# EAGLE design nixie_ticker (EAGLE 9.1.1)
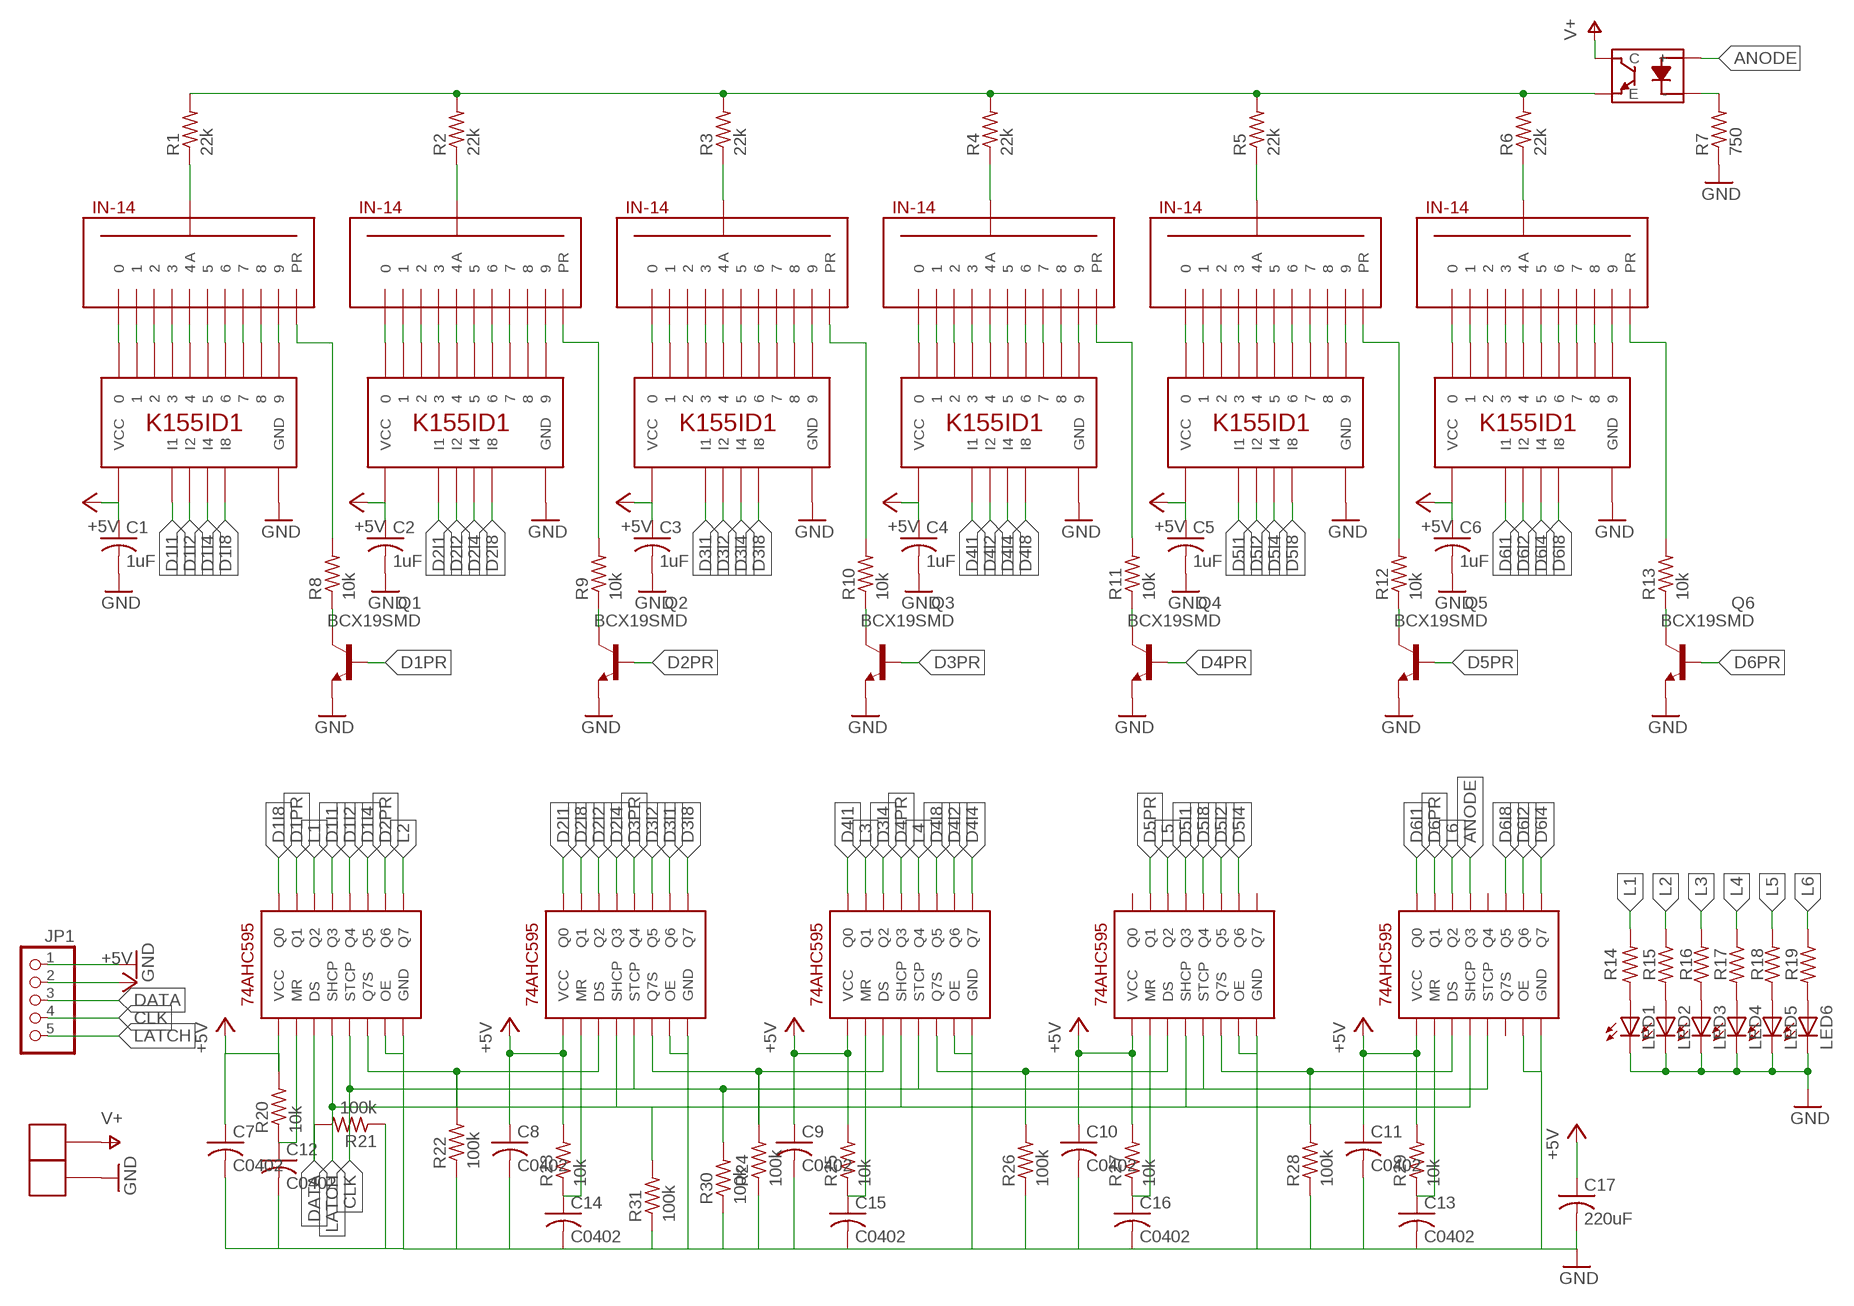
[diagram p0: schematic, sheet 1]

## Parts
C1  1uF  C0402  [C0402]
C2  1uF  C0402  [C0402]
C3  1uF  C0402  [C0402]
C4  1uF  C0402  [C0402]
C5  1uF  C0402  [C0402]
C6  1uF  C0402  [C0402]
C7  C0402  [C0402]
C8  C0402  [C0402]
C9  C0402  [C0402]
C10  C0402  [C0402]
C11  C0402  [C0402]
C12  C0402  [C0402]
C13  C0402  [C0402]
C14  C0402  [C0402]
C15  C0402  [C0402]
C16  C0402  [C0402]
C17  220uF  UUR1C221MCL6GS  [CAPAE830X1050]
JP1  PINHD-1X5  [1X05]
JP2  ZKFDS  [ZKFDS]
JP3  ZKFDS  [ZKFDS]
LED1  LEDCHIP-LED0603  [CHIP-LED0603]
LED2  LEDCHIP-LED0603  [CHIP-LED0603]
LED3  LEDCHIP-LED0603  [CHIP-LED0603]
LED4  LEDCHIP-LED0603  [CHIP-LED0603]
LED5  LEDCHIP-LED0603  [CHIP-LED0603]
LED6  LEDCHIP-LED0603  [CHIP-LED0603]
N1  IN14_12PIN12PIN  [IN14-12PIN]
N2  IN14_12PIN12PIN  [IN14-12PIN]
N3  IN14_12PIN12PIN  [IN14-12PIN]
N4  IN14_12PIN12PIN  [IN14-12PIN]
N5  IN14_12PIN12PIN  [IN14-12PIN]
N6  IN14_12PIN12PIN  [IN14-12PIN]
Q1  BCX19SMD  [SOT23-BEC]
Q2  BCX19SMD  [SOT23-BEC]
Q3  BCX19SMD  [SOT23-BEC]
Q4  BCX19SMD  [SOT23-BEC]
Q5  BCX19SMD  [SOT23-BEC]
Q6  BCX19SMD  [SOT23-BEC]
R1  22k  R-US_R1206  [R1206]
R2  22k  R-US_R1206  [R1206]
R3  22k  R-US_R1206  [R1206]
R4  22k  R-US_R1206  [R1206]
R5  22k  R-US_R1206  [R1206]
R6  22k  R-US_R1206  [R1206]
R7  750  R-US_R0603  [R0603]
R8  10k  R-US_R0805  [R0805]
R9  10k  R-US_R0805  [R0805]
R10  10k  R-US_R0805  [R0805]
R11  10k  R-US_R0805  [R0805]
R12  10k  R-US_R0805  [R0805]
R13  10k  R-US_R0805  [R0805]
R14  R-US_R0805  [R0805]
R15  R-US_R0805  [R0805]
R16  R-US_R0805  [R0805]
R17  R-US_R0805  [R0805]
R18  R-US_R0805  [R0805]
R19  R-US_R0805  [R0805]
R20  10k  R0402  [R0402]
R21  100k  R0402  [R0402]
R22  100k  R0402  [R0402]
R23  10k  R0402  [R0402]
R24  100k  R0402  [R0402]
R25  10k  R0402  [R0402]
R26  100k  R0402  [R0402]
R27  10k  R0402  [R0402]
R28  100k  R0402  [R0402]
R29  10k  R0402  [R0402]
R30  100k  R0402  [R0402]
R31  100k  R0402  [R0402]
U1  TLP3873D  [SOP254P1000X215-4]
U2  K155ID1  [DIP-16_SMD]
U3  K155ID1  [DIP-16_SMD]
U4  K155ID1  [DIP-16_SMD]
U5  K155ID1  [DIP-16_SMD]
U6  K155ID1  [DIP-16_SMD]
U7  K155ID1  [DIP-16_SMD]
U8  74AHC595  [16SOIC]
U9  74AHC595  [16SOIC]
U10  74AHC595  [16SOIC]
U11  74AHC595  [16SOIC]
U12  74AHC595  [16SOIC]

## Nets
+5V: C1.1(+) C2.1(+) C3.1(+) C4.1(+) C5.1(+) C6.1(+) C7.1(+) C8.1(+) C9.1(+) C10.1(+) C11.1(+) C17.1(+) JP1.2 R20.2 R23.2 R25.2 R27.2 R29.2 U2.P$5(VCC) U3.P$5(VCC) U4.P$5(VCC) U5.P$5(VCC) U6.P$5(VCC) U7.P$5(VCC) U8.P$16(VCC) U9.P$16(VCC) U10.P$16(VCC) U11.P$16(VCC) U12.P$16(VCC)
ANODE: U1.1(+) U12.P$3(Q3)
CLK: JP1.4 R30.2 U8.P$12(STCP) U9.P$12(STCP) U10.P$12(STCP) U11.P$12(STCP) U12.P$12(STCP)
D1I1: U2.P$3(I1) U8.P$3(Q3)
D1I2: U2.P$6(I2) U8.P$4(Q4)
D1I4: U2.P$7(I4) U8.P$5(Q5)
D1I8: U2.P$4(I8) U8.P$15(Q0)
D1PR: Q1.B U8.P$1(Q1)
D2I1: U3.P$3(I1) U9.P$15(Q0)
D2I2: U3.P$6(I2) U9.P$2(Q2)
D2I4: U3.P$7(I4) U9.P$3(Q3)
D2I8: U3.P$4(I8) U9.P$1(Q1)
D2PR: Q2.B U8.P$6(Q6)
D3I1: U4.P$3(I1) U9.P$6(Q6)
D3I2: U4.P$6(I2) U9.P$5(Q5)
D3I4: U4.P$7(I4) U10.P$2(Q2)
D3I8: U4.P$4(I8) U9.P$7(Q7)
D3PR: Q3.B U9.P$4(Q4)
D4I1: U5.P$3(I1) U10.P$15(Q0)
D4I2: U5.P$6(I2) U10.P$6(Q6)
D4I4: U5.P$7(I4) U10.P$7(Q7)
D4I8: U5.P$4(I8) U10.P$5(Q5)
D4PR: Q4.B U10.P$3(Q3)
D5I1: U6.P$3(I1) U11.P$3(Q3)
D5I2: U6.P$6(I2) U11.P$5(Q5)
D5I4: U6.P$7(I4) U11.P$6(Q6)
D5I8: U6.P$4(I8) U11.P$4(Q4)
D5PR: Q5.B U11.P$1(Q1)
D6I1: U7.P$3(I1) U12.P$15(Q0)
D6I2: U7.P$6(I2) U12.P$6(Q6)
D6I4: U7.P$7(I4) U12.P$7(Q7)
D6I8: U7.P$4(I8) U12.P$5(Q5)
D6PR: Q6.B U12.P$1(Q1)
DATA: JP1.3 R21.2 U8.P$14(DS)
GND: C1.2(-) C2.2(-) C3.2(-) C4.2(-) C5.2(-) C6.2(-) C7.2(-) C8.2(-) C9.2(-) C10.2(-) C11.2(-) C12.2(-) C13.2(-) C14.2(-) C15.2(-) C16.2(-) C17.2(-) JP1.1 JP3.P$1 JP3.P$2 LED1.C LED2.C LED3.C LED4.C LED5.C LED6.C Q1.E Q2.E Q3.E Q4.E Q5.E Q6.E R7.1 R21.1 R22.1 R24.1 R26.1 R28.1 R30.1 R31.1 U2.P$12(GND) U3.P$12(GND) U4.P$12(GND) U5.P$12(GND) U6.P$12(GND) U7.P$12(GND) U8.P$8(GND) U8.P$13(OE) U9.P$8(GND) U9.P$13(OE) U10.P$8(GND) U10.P$13(OE) U11.P$8(GND) U11.P$13(OE) U12.P$8(GND) U12.P$13(OE)
L1: R14.2 U8.P$2(Q2)
L2: R15.1 U8.P$7(Q7)
L3: R16.2 U10.P$1(Q1)
L4: R17.1 U10.P$4(Q4)
L5: R18.2 U11.P$2(Q2)
L6: R19.1 U12.P$2(Q2)
LATCH: JP1.5 R31.2 U8.P$11(SHCP) U9.P$11(SHCP) U10.P$11(SHCP) U11.P$11(SHCP) U12.P$11(SHCP)
N$1: N1.P$12 U2.P$16
N$2: N1.P$3 U2.P$15
N$3: N1.P$4 U2.P$8
N$4: N1.P$5 U2.P$9
N$5: N1.P$6 U2.P$13
N$6: N1.P$7 U2.P$14
N$7: N1.P$8 U2.P$11
N$8: N1.P$9 U2.P$10
N$9: N1.P$10 U2.P$1
N$10: N1.P$11 U2.P$2
N$11: N2.P$12 U3.P$16
N$12: N2.P$3 U3.P$15
N$13: N2.P$4 U3.P$8
N$14: N2.P$5 U3.P$9
N$15: N2.P$6 U3.P$13
N$16: N2.P$7 U3.P$14
N$17: N2.P$8 U3.P$11
N$18: N2.P$9 U3.P$10
N$19: N2.P$10 U3.P$1
N$20: N2.P$11 U3.P$2
N$21: R24.2 U9.P$9(Q7S) U10.P$14(DS)
N$22: R22.2 U8.P$9(Q7S) U9.P$14(DS)
N$23: R26.2 U10.P$9(Q7S) U11.P$14(DS)
N$24: R28.2 U11.P$9(Q7S) U12.P$14(DS)
N$25: LED2.A R15.2
N$26: C13.1(+) R29.1 U12.P$10(MR)
N$27: LED3.A R16.1
N$29: LED1.A R14.1
N$30: LED4.A R17.2
N$31: N3.P$12 U4.P$16
N$32: N3.P$3 U4.P$15
N$33: N3.P$4 U4.P$8
N$34: N3.P$5 U4.P$9
N$35: N3.P$6 U4.P$13
N$36: N3.P$7 U4.P$14
N$37: N3.P$8 U4.P$11
N$38: N3.P$9 U4.P$10
N$39: N3.P$10 U4.P$1
N$40: N3.P$11 U4.P$2
N$42: LED5.A R18.1
N$44: LED6.A R19.2
N$45: N1.P$2(PR) R8.2
N$46: Q1.C R8.1
N$47: N3.P$2(PR) R10.2
N$48: Q3.C R10.1
N$49: N5.P$2(PR) R12.2
N$50: Q5.C R12.1
N$51: N6.P$2(PR) R13.2
N$52: Q6.C R13.1
N$57: N1.P$1(A) R1.1
N$61: N4.P$12 U5.P$16
N$62: N4.P$3 U5.P$15
N$63: N4.P$4 U5.P$8
N$64: N4.P$5 U5.P$9
N$65: N4.P$6 U5.P$13
N$66: N4.P$7 U5.P$14
N$67: N4.P$8 U5.P$11
N$68: N4.P$9 U5.P$10
N$69: N4.P$10 U5.P$1
N$70: N4.P$11 U5.P$2
N$90: N5.P$1(A) R5.1
N$91: N5.P$12 U6.P$16
N$92: N5.P$3 U6.P$15
N$93: N5.P$4 U6.P$8
N$94: N5.P$5 U6.P$9
N$95: N5.P$6 U6.P$13
N$96: N5.P$7 U6.P$14
N$97: N5.P$8 U6.P$11
N$98: N5.P$9 U6.P$10
N$99: N5.P$10 U6.P$1
N$100: N5.P$11 U6.P$2
N$102: R1.2 R2.2 R3.2 R4.2 R5.2 R6.2 U1.3(E)
N$103: R7.2 U1.2(-)
N$104: N6.P$1(A) R6.1
N$105: N2.P$1(A) R2.1
N$108: C14.1(+) R23.1 U9.P$10(MR)
N$109: C12.1(+) R20.1 U8.P$10(MR)
N$110: C15.1(+) R25.1 U10.P$10(MR)
N$111: C16.1(+) R27.1 U11.P$10(MR)
N$118: N3.P$1(A) R3.1
N$121: N6.P$12 U7.P$16
N$122: N6.P$3 U7.P$15
N$123: N6.P$4 U7.P$8
N$124: N6.P$5 U7.P$9
N$125: N6.P$6 U7.P$13
N$126: N6.P$7 U7.P$14
N$127: N6.P$8 U7.P$11
N$128: N6.P$9 U7.P$10
N$129: N6.P$10 U7.P$1
N$130: N6.P$11 U7.P$2
N$145: N4.P$1(A) R4.1
N$160: Q2.C R9.1
N$161: Q4.C R11.1
N$162: N4.P$2(PR) R11.2
N$163: N2.P$2(PR) R9.2
V+: JP2.P$1 JP2.P$2 U1.4(C)
Unconnected: U11.P$7(Q7) U11.P$15(Q0) U12.P$4(Q4) U12.P$9(Q7S)

## Library data of the parts
C1-C16 = nixie_ticker:C0402
C17 = nixie_ticker:UUR1C221MCL6GS
JP1 = pinhead:PINHD-1X5: PIN HEADER
JP2 JP3 = nixie_ticker:ZKFDS
LED1-LED6 = led:LED: LED OSRAM: - CHIPLED LG R971, LG N971, LY N971, LG Q971, LY Q971, LO R971, LY R971 LH N974, LH R974 LS Q976, LO Q976, LY Q976 LO Q996 - Hyper CHIPLED LW Q18S LB Q993, LB Q99A, LB R99A - SideLED LS A670, LO A670, LY A670, LG A670, LP A670 LB A673, LV A673, LT A673, LW A673 LH A674 LY A675 LS A676, LA A676, LO A676, LY A676, LW A676 LS A679, LY A679, LG A679 - Hyper Micro SIDELED® LS Y876, LA Y876, LO Y876, LY Y876 LT Y87S - SmartLED LW L88C, LW L88S LB L89C, LB L89S, LG L890 LS L89K, LO L89K, LY L89K LS L896, LA L896, LO L896, LY L896 - TOPLED LS T670, LO T670, LY T670, LG T670, LP T670 LSG T670, LSP T670, LSY T670, LOP T670, LYG T670 LG T671, LOG T671, LSG T671 LB T673, LV T673, LT T673, LW T673 LH T674 LS T676, LA T676, LO T676, LY T676, LB T676, LH T676, LSB T676, LW T676 LB T67C, LV T67C, LT T67C, LS T67K, LO T67K, LY T67K, LW E67C LS E67B, LA E67B, LO E67B, LY E67B, LB E67C, LV E67C, LT E67C LW T67C LS T679, LY T679, LG T679 LS T770, LO T770, LY T770, LG T770, LP T770 LB T773, LV T773, LT T773, LW T773 LH T774 LS E675, LA E675, LY E675, LS T675 LS T776, LA T776, LO T776, LY T776, LB T776 LHGB T686 LT T68C, LB T68C - Hyper Mini TOPLED® LB M676 - Mini TOPLED Santana® LG M470 LS M47K, LO M47K, LY M47K Source: http://www.osram.convergy.de LUXEON: - LUMILED® LXK2-PW12-R00, LXK2-PW12-S00, LXK2-PW14-U00, LXK2-PW14-V00 LXK2-PM12-R00, LXK2-PM12-S00, LXK2-PM14-U00 LXK2-PE12-Q00, LXK2-PE12-R00, LXK2-PE12-S00, LXK2-PE14-T00, LXK2-PE14-U00 LXK2-PB12-K00, LXK2-PB12-L00, LXK2-PB12-M00, LXK2-PB14-N00, LXK2-PB14-P00, LXK2-PB14-Q00 LXK2-PR12-L00, LXK2-PR12-M00, LXK2-PR14-Q00, LXK2-PR14-R00 LXK2-PD12-Q00, LXK2-PD12-R00, LXK2-PD12-S00 LXK2-PH12-R00, LXK2-PH12-S00 LXK2-PL12-P00, LXK2-PL12-Q00, LXK2-PL12-R00 Source: www.luxeon.com KINGBRIGHT: KA-3528ASYC Source: www.kingbright.com
N1-N6 = nixie_ticker:IN14_12PIN
Q1-Q6 = transistor-npn:BCX19*: NPN Transistor
R1-R19 = resistor:R-US_: RESISTOR, American symbol
R20-R31 = nixie_ticker:R0402
U1 = nixie_ticker:TLP387
U2-U7 = nixie_ticker:K155ID1
U8-U12 = nixie_ticker:74AHC595

## Board
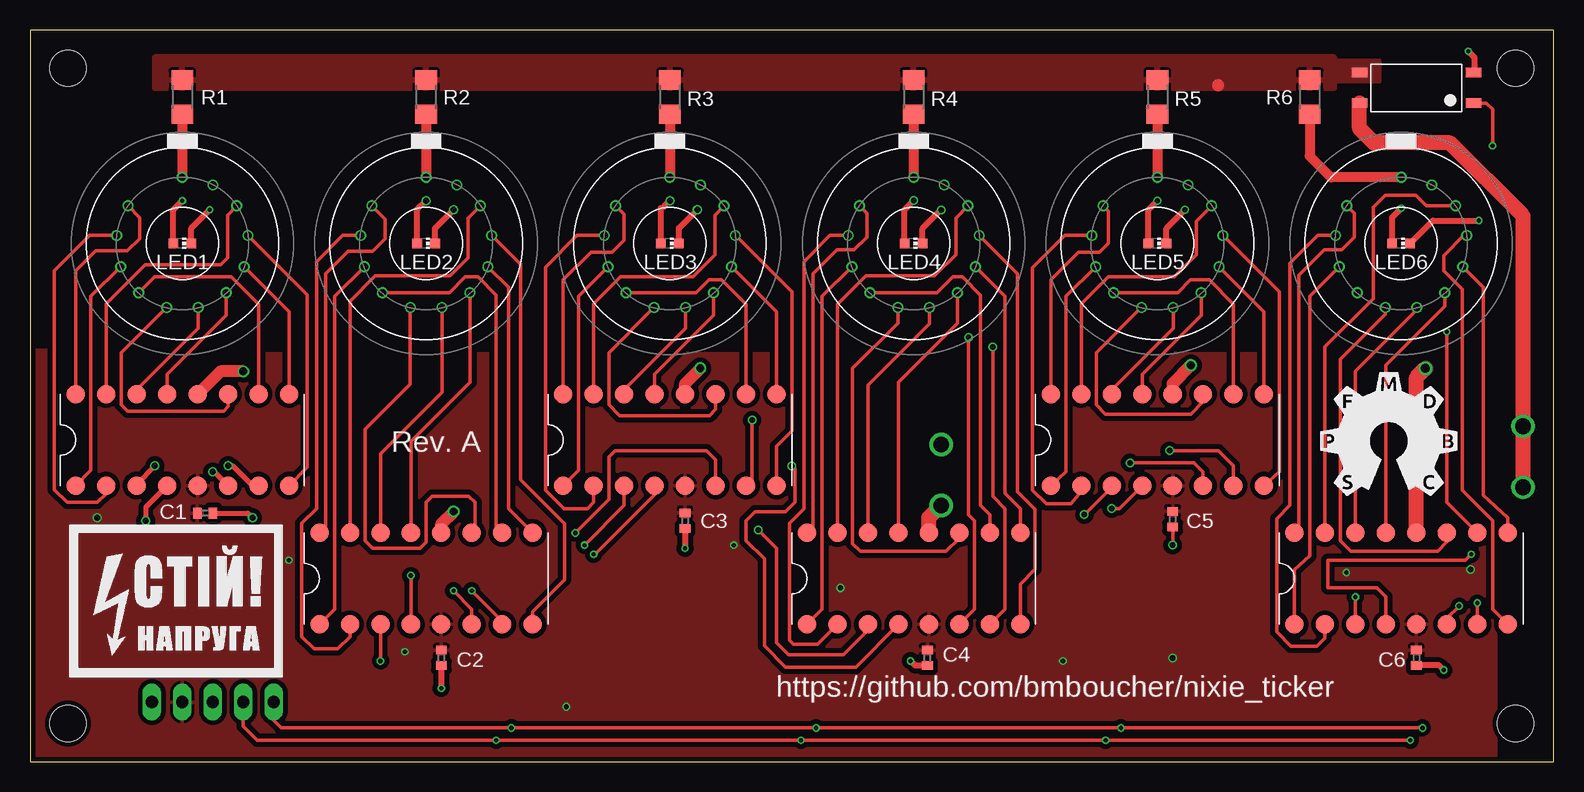
[diagram p1: board, top side]
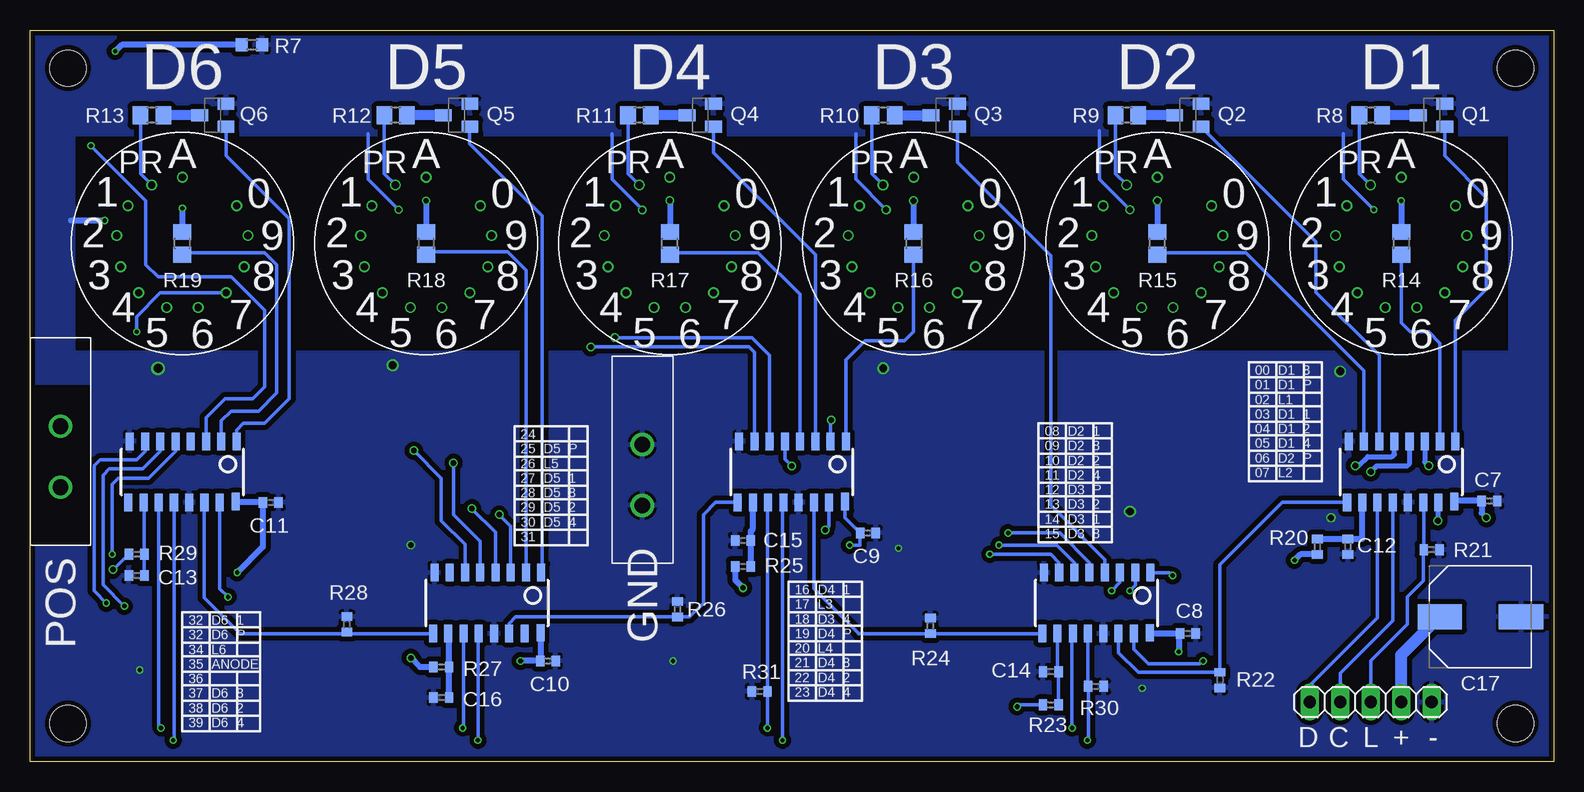
[diagram p2: board, bottom side, seen from below]

Size 127 x 60.96 mm. Coordinates in mm from the lower left corner, seen from the top.
Outline: 0,0 127,0 127,60.96 0,60.96 0,0
Copper layers (1*16): Top 0.035559375mm / dielectric 1.6mm / Bottom 0.035559375mm
Design rules "oshpark-2layer *": minimum track width 6mil, minimum drill 10mil, track to track 12mil, track to pad 12mil, pad to pad 6mil, via to via 6mil, smd to smd 6mil, copper to edge 15mil, drill to drill 6mil, minimum pad ring 5mil, minimum via ring 5mil, stop-mask expansion 2.5mil, vias tented up to drill 35mil, thermal gap 10mil
Holes 3 mm at 3.17,57.78 3.17,3.17 123.83,3.17 123.83,57.78

### Footprints (pad centres in the part's own frame; a part is rotated, then mirrored left to right if it is on the bottom)
C0402 = smd 0.7 x 0.9: 1 -0.65,0; 2 0.65,0
CAPAE830X1050 = smd 3.687 x 2.12: 1 -3.388,0; 2 3.388,0
1X05 = drill 1.016 long: 1 -5.08,0; 2 -2.54,0; 3 0,0; 4 2.54,0; 5 5.08,0
ZKFDS = drill 1.3: P$1 0,5.08; P$2 0,0
CHIP-LED0603 = smd 0.8 x 0.8: A 0,-0.75; C 0,0.75
IN14-12PIN = drill 0.6: P$1 0,5.5; P$2 2.556,4.87; P$3 4.526,3.124; P$4 5.46,0.663; P$5 5.143,-1.95; P$6 3.647,-4.117; P$7 1.316,-5.34; P$8 -1.316,-5.34; P$9 -3.647,-4.117; P$10 -5.143,-1.95; P$11 -5.46,0.663; P$12 -4.526,3.124
SOT23-BEC = smd 1 x 1.4: B -0.95,-1.1; C 0,1.1; E 0.95,-1.1
R1206 = smd 1.6 x 1.803: 1 -1.422,0; 2 1.422,0
R0603 = smd 1 x 1.1: 1 -0.85,0; 2 0.85,0
R0805 = smd 1.3 x 1.5: 1 -0.95,0; 2 0.95,0
R0402 = smd 0.7 x 0.9: 1 -0.65,0; 2 0.65,0
SOP254P1000X215-4 = smd 1.3 x 0.8: 1 -4.75,1.27; 2 -4.75,-1.27; 3 4.75,-1.27; 4 4.75,1.27
DIP-16_SMD = smd 1.524 x 1.524: P$1 -3.81,8.89; P$2 -3.81,6.35; P$3 -3.81,3.81; P$4 -3.81,1.27; P$5 -3.81,-1.27; P$6 -3.81,-3.81; P$7 -3.81,-6.35; P$8 -3.81,-8.89; P$9 3.81,-8.89; P$10 3.81,-6.35; P$11 3.81,-3.81; P$12 3.81,-1.27; P$13 3.81,1.27; P$14 3.81,3.81; P$15 3.81,6.35; P$16 3.81,8.89
16SOIC = smd 0.67 x 1.45: P$1 -4.51,-2.54; P$2 -3.24,-2.54; P$3 -1.97,-2.54; P$4 -0.7,-2.54; P$5 0.57,-2.54; P$6 1.84,-2.54; P$7 3.11,-2.54; P$8 4.38,-2.54; P$9 4.51,2.54; P$10 3.24,2.54; P$11 1.97,2.54; P$12 0.7,2.54; P$13 -0.57,2.54; P$14 -1.84,2.54; P$15 -3.11,2.54; P$16 -4.445,2.475

### Placement (x,y rotation side)
C1  14.61,20.7 0 top
C2  34.29,8.64 270 top
C3  54.61,20.07 270 top
C4  74.8,8.64 270 top
C5  95.25,20.19 270 top
C6  115.57,8.64 270 top
C7  5.33,21.72 0 bottom
C8  30.48,10.67 0 bottom
C9  57.15,19.05 0 bottom
C10  83.82,8.38 0 bottom
C11  106.93,21.59 0 bottom
C12  17.14,17.91 270 bottom
C13  118.11,15.49 180 bottom
C14  41.91,7.49 180 bottom
C15  67.56,18.41 180 bottom
C16  92.71,5.33 180 bottom
C17  6.1,12.06 0 bottom
JP1  15.24,4.95 180 bottom
JP2  124.46,22.86 0 bottom
JP3  75.95,21.34 0 bottom
LED1  12.7,43.18 270 top
LED2  33.02,43.18 270 top
LED3  53.34,43.18 270 top
LED4  73.66,43.18 270 top
LED5  93.98,43.18 270 top
LED6  114.3,43.18 270 top
N1  12.7,43.18 0 top
N2  33.02,43.18 0 top
N3  53.34,43.18 0 top
N4  73.66,43.18 0 top
N5  93.98,43.18 0 top
N6  114.3,43.18 0 top
Q1  10.16,53.85 90 bottom
Q2  30.48,53.85 90 bottom
Q3  50.8,53.85 90 bottom
Q4  71.12,53.85 90 bottom
Q5  91.44,53.85 90 bottom
Q6  111.76,53.85 90 bottom
R1  12.7,55.37 90 top
R2  33.02,55.37 90 top
R3  53.34,55.37 90 top
R4  73.66,55.37 90 top
R5  93.98,55.37 90 top
R6  106.68,55.37 90 top
R7  108.5,59.73 180 bottom
R8  15.24,53.85 180 bottom
R9  35.56,53.85 180 bottom
R10  55.88,53.85 180 bottom
R11  76.2,53.85 180 bottom
R12  96.52,53.85 180 bottom
R13  116.84,53.85 180 bottom
R14  12.7,43.18 270 bottom
R15  33.02,43.18 90 bottom
R16  53.34,43.18 270 bottom
R17  73.66,43.18 90 bottom
R18  93.98,43.18 270 bottom
R19  114.3,43.18 90 bottom
R20  19.68,17.91 270 bottom
R21  10.16,17.65 180 bottom
R22  27.81,6.79 90 bottom
R23  41.91,4.72 180 bottom
R24  51.94,11.3 270 bottom
R25  67.56,16.26 180 bottom
R26  73.03,12.7 270 bottom
R27  92.71,7.87 180 bottom
R28  100.58,11.43 270 bottom
R29  118.11,17.27 180 bottom
R30  38.14,6.26 180 bottom
R31  66.17,5.84 0 bottom
U1  115.57,56.13 180 top
U2  12.7,26.8 90 top
U3  33.02,15.24 90 top
U4  53.34,26.8 90 top
U5  73.66,15.24 90 top
U6  93.98,26.8 90 top
U7  114.3,15.24 90 top
U8  12.7,24.13 180 bottom
U9  38.1,13.21 180 bottom
U10  63.5,24.13 180 bottom
U11  88.9,13.21 180 bottom
U12  114.3,24.13 180 bottom

### Tracks (layer width: path | path; a pad name or v marks a point on that pad's centre or on a via)
+5V  (via drill 0.35, 0.4, 0.45, 0.5)
  Bottom 0.305: v58.67,18.03 57.8,18.03 C9.1 59.07,20.32 59.07,21.64 U10.P$16 | R23.2 44.7,4.72 v44.7,4.57 | R29.2 120.03,16 v120.09,16
  Bottom 0.508: U8.P$16 8.19,21.72 C7.1 5.98,20.72 v5.59,20.32 | R20.2 21.1,17.26 v21.59,16.76 | R25.2 68.21,15.13 v67.56,14.48 | U9.P$16 33.59,10.67 C8.1 31.24,10.67 v31.24,9.14 | U11.P$16 84.45,8.38 C10.1 v86.11,8.38 | R27.2 94.49,7.87 v95.25,8.64 | U12.P$16 109.79,21.59 C11.1 107.58,17.89 v109.73,15.75
  Bottom 1.016: JP1.2 12.7,8.89 9.91,11.68 9.87,11.68 C17.1
  pour Top (isolate 0.406, rank 4): 0,34.29 122.17,34.29 122.17,0 0,0
  cutout Top (isolate 0.406, rank 4): 3.81,52.07 123.09,52.07 123.19,51.97 123.19,34.29 3.81,34.29
ANODE  (via drill 0.35)
  Top 0.305: v121.92,51.31 121.92,54.36 121.41,54.86 U1.1
  Bottom 0.305: U12.P$3 112.33,28.64 110.74,30.23 108.46,30.23 107.44,31.24 107.44,37.59 110.24,40.39 116.33,40.39 117.35,41.4 117.35,46.74 v121.92,51.31
CLK  (via drill 0.35)
  Top 0.305: v115.06,1.78 v89.66,1.78 v64.26,1.78 v38.86,1.78 18.92,1.78 17.78,2.92 JP1.4
  Bottom 0.305: JP1.4 17.78,7.37 13.4,11.75 U8.P$12 | U12.P$12 115,1.78 v115.06,1.78 | U9.P$12 R30.2 38.79,1.78 v38.86,1.78 | v64.26,1.78 64.26,21.59 U10.P$12 | U11.P$12 89.66,10.67 v89.66,1.78
D1I1  (via drill 0.5)
  Top 0.406: v10.41,24.64 8.89,23.11 U2.P$3
  Bottom 0.406: U8.P$3 10.73,24.95 v10.41,24.64
D1I2  (via drill 0.5)
  Top 0.406: U2.P$6 15.37,24.13 v15.24,24.13
  Bottom 0.406: U8.P$4 12,24.83 12.19,24.64 14.73,24.64 v15.24,24.13
D1I4  (via drill 0.5)
  Top 0.406: U2.P$7 18.54,22.99 16.89,24.64 v16.51,24.64
  Bottom 0.406: U8.P$5 13.27,25.59 13.46,25.4 15.49,25.4 16.26,24.64 v16.51,24.64
D1I8  (via drill 0.5)
  Top 0.406: U2.P$4 9.65,21.21 v9.65,20.07
  Bottom 0.406: v9.65,20.07 9.59,20.13 U8.P$15
D1PR
  Bottom 0.305: U8.P$1 8.19,36.77 5.59,39.37 5.59,46.99 9.06,50.46 Q1.B
D2I1  (via drill 0.35)
  Top 0.305: v29.21,8.38 U3.P$3
  Bottom 0.305: U9.P$15 34.99,9.34 33.78,8.13 29.46,8.13 v29.21,8.38
D2I2  (via drill 0.35)
  Top 0.305: v35.31,14.22 36.83,12.7 U3.P$6
  Bottom 0.305: v35.31,14.22 34.86,14.67 U9.P$2
D2I4  (via drill 0.35)
  Top 0.305: v36.83,14.22 39.37,11.68 U3.P$7
  Bottom 0.305: v36.83,14.22 36.13,14.92 U9.P$3
D2I8  (via drill 0.35)
  Top 0.305: v31.75,15.49 U3.P$4
  Bottom 0.305: U9.P$1 32,15.75 v31.75,15.49
D2PR
  Bottom 0.305: Q2.B 19.81,43.33 19.81,39.12 14.54,33.84 U8.P$6
D3I1  (via drill 0.35)
  Top 0.305: v46.23,18.03 49.53,21.34 U4.P$3
  Bottom 0.305: U9.P$6 39.94,16.57 41.4,18.03 v46.23,18.03
D3I2  (via drill 0.35)
  Top 0.305: v45.47,19.05 48.26,21.84 48.26,25.4 48.77,25.91 56.39,25.91 57.15,25.15 U4.P$6
  Bottom 0.305: U9.P$5 38.67,16.57 41.15,19.05 v45.47,19.05
D3I4  (via drill 0.45)
  Top 0.305: U4.P$7 60.2,23.5 v60.2,28.45
  Bottom 0.305: U10.P$2 60.26,28.39 v60.2,28.45
D3I8  (via drill 0.35)
  Top 0.305: v46.99,17.27 47.12,17.27 52.07,22.23 U4.P$4
  Bottom 0.305: U9.P$7 41.21,16.57 41.91,17.27 v46.99,17.27
D3PR
  Bottom 0.305: Q3.B 49.7,49.95 41.91,42.16 41.91,21.34 37.4,16.83 U9.P$4
D4I1  (via drill 0.45)
  Top 0.305: v60.71,19.3 62.23,17.78 62.23,9.91 63.25,8.89 67.82,8.89 69.85,10.92 U5.P$3
  Bottom 0.305: U10.P$15 60.39,19.62 v60.71,19.3
D4I2  (via drill 0.45)
  Top 0.305: v78.23,35.35 78.23,20.57 78.74,20.07 78.74,12.7 U5.P$6
  Bottom 0.305: U10.P$6 65.34,33.84 66.8,35.31 78.19,35.31 v78.23,35.35
D4I4  (via drill 0.45)
  Top 0.305: v80.26,34.54 80.26,22.1 81.28,21.08 81.28,12.7 U5.P$7
  Bottom 0.305: U10.P$7 66.61,34.1 67.06,34.54 v80.26,34.54
D4I8  (via drill 0.45)
  Top 0.305: v63.5,24.64 63.75,24.38 63.75,21.59 62.99,20.83 60.45,20.83 59.69,20.07 59.69,18.41 61.21,16.89 61.21,9.65 62.99,7.87 68.83,7.87 U5.P$4
  Bottom 0.305: U10.P$5 64.07,25.21 v63.5,24.64
D4PR
  Bottom 0.305: U10.P$3 61.53,42.23 70.02,50.72 Q4.B
D5I1  (via drill 0.45)
  Top 0.305: v87.88,20.57 90.17,22.86 U6.P$3
  Bottom 0.305: U11.P$3 86.93,19.62 v87.88,20.57
D5I2  (via drill 0.45)
  Top 0.305: v91.69,24.89 97.03,24.89 97.79,24.13 U6.P$6
  Bottom 0.305: U11.P$5 89.47,18.35 91.69,20.57 v91.69,24.89
D5I4  (via drill 0.45)
  Top 0.305: v95,25.91 99.06,25.91 100.33,24.64 U6.P$7
  Bottom 0.305: U11.P$6 90.74,18.1 92.71,20.07 92.71,23.62 v95,25.91
D5I8  (via drill 0.45)
  Top 0.305: v90.17,21.08 90.81,21.08 U6.P$4
  Bottom 0.305: U11.P$4 88.2,19.11 v90.17,21.08
D5PR
  Bottom 0.305: Q5.B 90.34,51.48 84.33,45.47 84.33,15.81
  Bottom 0.508: 84.33,15.81 U11.P$1
D6I1  (via drill 0.35)
  Top 0.305: v110.49,13.72 U7.P$3
  Bottom 0.305: U12.P$15 111.19,14.42 v110.49,13.72
D6I2  (via drill 0.35)
  Top 0.305: v119.13,12.95 118.11,11.94 U7.P$6
  Bottom 0.305: U12.P$6 116.14,25.85 117.6,24.38 120.4,24.38 120.9,23.88 120.9,14.73 v119.13,12.95
D6I4  (via drill 0.35)
  Top 0.305: v120.65,13.21 U7.P$7
  Bottom 0.305: U12.P$7 117.41,25.85 118.11,25.15 121.16,25.15 121.67,24.64 121.67,14.22 v120.65,13.21
D6I8  (via drill 0.35)
  Top 0.305: v120.14,17.27 119.63,16.76 108.21,16.76 108.21,14.48 112.27,14.48 113.03,13.72 U7.P$4
  Bottom 0.305: U12.P$5 114.87,25.85 117.09,23.62 119.63,23.62 120.14,23.11 v120.14,17.27
D6PR
  Bottom 0.305: Q6.B 110.66,50.46 105.41,45.21 105.41,30.23 107.44,28.19 109.22,28.19 109.79,27.62 U12.P$1
DATA
  Bottom 0.305: JP1.3 15.24,8.38 12.19,11.43 12.19,13.72 10.86,15.05 10.86,17.6 | R21.2 10.81,21.54
  Bottom 0.508: 10.86,17.6 R21.2 | 10.81,21.54 U8.P$14
GND  (via drill 0.35, 0.4, 0.45, 0.5, 0.65 pad 0.75, 0.75)
  Top 0.305: C5.2 v95.25,18.03
  Top 0.406: C1.2 18.16,20.7 v18.54,20.32
  Top 0.508: LED1.C 13.45,44.44 v14.99,45.97 | v35.31,45.97 33.77,44.44 LED2.C | C2.2 v34.29,6.1 | C6.2 115.57,8.02 117.46,8.02 v117.86,7.62 | C4.2 73.8,7.99 v73.41,8.38 | C3.2 v54.61,17.78 | v55.63,45.97 55.63,45.93 55.59,45.95 54.09,44.45 LED3.C | LED4.C 74.41,44.44 v75.95,45.97 | LED5.C 94.73,44.44 v96.27,45.97 | LED6.C 116.95,45.09 v120.78,45.09
  Top 1.016: v17.78,32.51 15.88,32.51 U2.P$12 | 34.29,19.3 U3.P$12 34.29,19.81 v35.31,20.83 | U4.P$12 54.61,31.5 v55.88,32.77 | U6.P$12 95.25,31.5 v96.77,33.02
  Top 1.27: U7.P$12 115.57,32 v116.33,32.77 | U5.P$12 74.93,20.32 JP3.P$2
  Bottom 0.305: v14.99,45.97 17.53,48.51 17.53,52.32 | v35.31,45.97 37.85,48.51 37.85,52.58 | v55.63,45.97 58.17,48.51 58.17,52.32 | v75.95,45.97 78.49,48.51 78.49,52.32 | v96.27,45.97 98.81,48.51 98.81,52.32
  Bottom 0.508: v120.78,45.09 123.57,45.09
  pour Bottom (isolate 0.406, rank 6): 0,60.96 127,60.96 127,0 0,0
L1
  Bottom 0.305: U8.P$2 9.46,34.86 10.41,35.81 11.94,35.81 12.7,36.58 R14.2
L2
  Bottom 0.305: U8.P$7 15.81,32.57 25.65,42.42 32.83,42.42
  Bottom 0.508: 32.83,42.42 R15.1
L3
  Bottom 0.305: R16.2 53.34,35.81 54.1,35.05 57.4,35.05 58.99,33.47 U10.P$1
L4
  Bottom 0.305: U10.P$4 62.8,38.92 66.29,42.42 73.47,42.42
  Bottom 0.508: 73.47,42.42 R17.1
L5
  Bottom 0.305: U11.P$2 85.66,40.96 87.2,42.49 93.72,42.49
  Bottom 0.508: 93.72,42.49 R18.2
L6
  Bottom 0.305: R19.1 114.11,42.42 107.44,42.42 106.43,41.4 106.43,30.73 107.95,29.21 110.24,29.21 111.06,28.39 U12.P$2
LATCH  (via drill 0.35)
  Top 0.305: v116.08,2.79 v90.93,2.79 v65.53,2.79 v40.13,2.79 20.95,2.79 20.32,3.43 JP1.5
  Bottom 0.305: JP1.5 20.32,6.35 14.67,12 U8.P$11 | U9.P$11 40.13,10.67 v40.13,2.79 | v65.53,2.79 65.53,5.83 R31.2 65.52,21.54 U10.P$11 | U11.P$11 90.87,2.79 v90.93,2.79 | U12.P$11 116.27,2.99 v116.08,2.79
N$1
  Top 0.305: N1.P$12 9.14,45.33 9.14,43.58 8.11,42.55 5.46,42.55 3.81,40.89 U2.P$16
N$2
  Top 0.305: U2.P$15 6.35,38.14 9.61,41.4 15.88,41.4 16.46,41.99 16.46,45.54 N1.P$3
N$3
  Top 0.305: U2.P$8 23.11,24.51 23.11,38.89 N1.P$4
N$4
  Top 0.305: U2.P$9 21.59,37.48 N1.P$5
N$5
  Top 0.305: U2.P$13 11.43,32.26 16.35,37.17 N1.P$6
N$6
  Top 0.305: U2.P$14 8.89,30.99 14.02,36.11 N1.P$7
N$7
  Top 0.305: U2.P$11 16.51,29.59 16.13,29.21 8.13,29.21 7.62,29.72 7.62,34.08 N1.P$8
N$8
  Top 0.305: U2.P$10 19.05,38.1 16.76,40.39 10.38,40.39 N1.P$9
N$9
  Top 0.305: U2.P$1 5.08,24.26 5.08,38.75 N1.P$10
N$10
  Top 0.305: N1.P$11 4.98,43.84 2.03,40.89 2.03,22.66 3.1,21.59 5.33,21.59 5.62,21.59 6.35,22.32 U2.P$2
N$11
  Top 0.305: U3.P$16 24.64,19.56 24.64,40.64 26.51,42.51 28.57,42.51 29.62,43.56 29.62,45.18 N2.P$12
N$12
  Top 0.305: U3.P$15 26.67,38.35 28.78,40.46 35.01,40.46 36.53,41.99 36.53,45.29 N2.P$3
N$13
  Top 0.305: U3.P$8 41.91,12.5 44.58,15.17 44.58,19.81 40.89,23.5 40.89,41.43 N2.P$4
N$14
  Top 0.305: U3.P$9 39.88,21.08 39.88,39.51 N2.P$5
N$15
  Top 0.305: U3.P$13 31.75,26.67 36.67,31.59 N2.P$6
N$16
  Top 0.305: U3.P$14 29.21,25.65 34.34,30.78 N2.P$7
N$17
  Top 0.305: N2.P$8 31.7,31.45 27.94,27.69 27.94,18.41 28.57,17.78 32.51,17.78 33.02,18.29 33.02,21.59 33.53,22.1 36.58,22.1 37.08,21.59 37.08,19.3 U3.P$11 37.08,18.8
N$18
  Top 0.305: U3.P$10 38.86,19.56 38.86,38.86 37.34,40.39 36.28,40.39 34.96,39.06 N2.P$9
N$19
  Top 0.305: U3.P$1 25.4,12.7 25.4,38.75 N2.P$10
N$20
  Top 0.305: N2.P$11 26.06,43.84 23.88,41.66 23.88,21.08 22.66,19.86 22.66,10.42 23.68,9.4 25.65,9.4 26.67,10.41 U3.P$2
N$21
  Bottom 0.305: 42.61,10.68 U9.P$9 51.94,10.67 R24.2 57.93,10.65 57.93,10.68 61.66,14.42 U10.P$14
N$22
  Bottom 0.305: U8.P$9 22.61,21.59 27.8,16.39 R22.2 34.62,7.44 36.26,9.08 U9.P$14
N$23
  Bottom 0.305: U11.P$14 87.06,11.49 86.5,12.05 R26.2 72.02,12.05 70.87,13.21 70.87,20.57 69.85,21.59 U10.P$9
N$24
  Bottom 0.305: U12.P$14 112.46,13.65 109.47,10.67 100.58,10.67 | 100.58,10.67 R28.2 100.58,10.67 | 100.58,10.67 U11.P$9
N$25  (via drill 0.5)
  Top 0.508: v33.02,46.74 32.29,46 32.27,45.99 LED2.A
  Bottom 0.508: R15.2 33.02,45.47 v33.02,46.74
N$26
  Bottom 0.305: C13.1 R29.1 117.46,21.51 U12.P$10
N$27  (via drill 0.5)
  Top 0.508: v53.34,46.74 52.86,46.26 52.59,46.11 LED3.A
  Bottom 0.508: v53.34,46.74 R16.1
N$29  (via drill 0.35)
  Top 0.508: v12.7,46.74 11.97,46 11.95,45.99 LED1.A
  Bottom 0.508: v12.7,46.74 R14.1
N$30  (via drill 0.45)
  Top 0.508: LED4.A 72.91,45.99 v73.66,46.74
  Bottom 0.508: v73.66,46.74 R17.2
N$31
  Top 0.305: U4.P$16 44.45,40.13 46.76,42.44 48.51,42.44 49.53,43.45 49.53,45.59 N3.P$12
N$32
  Top 0.305: U4.P$15 46.99,38.14 49.24,40.39 55.25,40.39 57.1,42.24 57.1,45.54 N3.P$3
N$33
  Top 0.305: N3.P$4 63.5,39.14 63.5,27.56 62.23,26.29 U4.P$8
N$34
  Top 0.305: U4.P$9 62.23,37.48 N3.P$5
N$35
  Top 0.305: U4.P$13 52.07,32.26 56.99,37.17 N3.P$6
N$36
  Top 0.305: U4.P$14 49.53,30.99 54.66,36.11 N3.P$7
N$37
  Top 0.305: U4.P$11 57.15,29.34 56.64,28.83 49.15,28.83 48.26,29.72 48.26,34.08 N3.P$8
N$38
  Top 0.305: U4.P$10 59.69,38.1 57.66,40.13 56.6,40.13 55.53,39.06 N3.P$9
N$39
  Top 0.305: U4.P$1 45.72,24.26 45.72,38.75 N3.P$10
N$40
  Top 0.305: N3.P$11 45.62,43.84 42.98,41.2 42.98,22.61 44.5,21.08 46.48,21.08 46.99,21.59 U4.P$2
N$42  (via drill 0.4)
  Top 0.508: LED5.A 93.23,45.99 v93.98,46.74
  Bottom 0.508: v93.98,46.74 R18.1
N$44  (via drill 0.35)
  Top 0.508: LED6.A 113.55,45.35 v114.3,46.1
  Bottom 0.508: v114.3,46.1 R19.2
N$45
  Bottom 0.305: R8.2 16.19,48.98 N1.P$2
N$46
  Bottom 0.813: Q1.C R8.1
N$47
  Bottom 0.305: R10.2 56.83,48.98 N3.P$2
N$48
  Bottom 0.813: R10.1 Q3.C
N$49
  Bottom 0.305: R12.2 97.47,48.98 N5.P$2
N$50
  Bottom 0.813: Q5.C R12.1
N$51
  Bottom 0.305: R13.2 117.79,48.98 N6.P$2
N$52
  Bottom 0.813: Q6.C R13.1
N$57
  Top 0.813: R1.1 N1.P$1
N$61
  Top 0.305: N4.P$12 69.75,45.69 69.75,43.69 68.7,42.64 67.27,42.64 65.28,40.64 65.28,26.67 65.28,19.34 65.18,19.46 U5.P$16
N$62
  Top 0.305: U5.P$15 67.31,38.1 69.67,40.46 75.39,40.46 77.17,42.24 77.17,45.29 N4.P$3
N$63
  Top 0.305: U5.P$8 82.55,14.79 83.77,16 83.77,21.01 82.3,22.48 82.3,40.67 N4.P$4
N$64
  Top 0.305: N4.P$5 81.28,38.75 81.28,22.35 82.55,21.08 U5.P$9
N$65
  Top 0.305: U5.P$13 72.39,31.62 77.31,36.54 N4.P$6
N$66
  Top 0.305: U5.P$14 69.85,31.37 74.98,36.49 N4.P$7
N$67
  Top 0.305: N4.P$8 72.34,36.53 68.58,32.77 68.58,18.16 69.22,17.53 76.38,17.53 77.47,18.62 U5.P$11
N$68
  Top 0.305: N4.P$9 75.6,39.06 76.92,40.39 77.72,40.39 79.25,38.86 79.25,21.34 80.01,20.57 U5.P$10
N$69
  Top 0.305: U5.P$1 66.04,12.7 66.04,38.75 N4.P$10
N$70
  Top 0.305: N4.P$11 66.7,43.84 64.52,41.66 64.52,21.08 63.3,19.86 63.3,10.67 | 63.3,10.42 63.3,10.67 | 63.3,10.67 63.3,10.11 63.63,9.78 65.66,9.78 U5.P$2
N$89
  cutout Bottom (isolate 0.406): 123.19,52.07 3.81,52.07 3.81,34.29 108.97,34.29 109.98,34.29 116.59,34.29 123.19,34.29
N$90
  Top 0.813: R5.1 N5.P$1
N$91
  Top 0.305: U6.P$16 85.09,40.13 87.39,42.44 89.15,42.44 89.92,43.2 89.92,45.84 N5.P$12
N$92
  Top 0.305: U6.P$15 87.63,38.14 89.88,40.39 95.38,40.39 97.24,42.24 97.24,45.03 N5.P$3
N$93
  Top 0.305: U6.P$8 104.14,24.13 104.14,39.14 N5.P$4
N$94
  Top 0.305: U6.P$9 102.87,37.48 N5.P$5
N$95
  Top 0.305: U6.P$13 92.71,32.26 97.63,37.17 N5.P$6
N$96
  Top 0.305: U6.P$14 90.17,30.99 95.3,36.11 N5.P$7
N$97
  Top 0.305: U6.P$11 97.79,29.97 96.77,28.96 89.66,28.96 88.9,29.72 88.9,34.08 N5.P$8
N$98
  Top 0.305: U6.P$10 100.33,38.1 98.3,40.13 96.74,40.13 95.67,39.06 N5.P$9
N$99
  Top 0.305: U6.P$1 86.36,24.13 86.36,38.75 N5.P$10
N$100
  Top 0.305: N5.P$11 86.26,43.84 83.57,41.15 83.57,22.61 84.71,21.46 86.77,21.46 87.63,22.54 U6.P$2
N$102
  Top 1.016: 99.06,56.32 99.06,56.39
  pour Top: 10.41,56.13 108.71,56.13 108.71,56.64 108.71,58.67 10.41,58.67
  pour Top (no thermals): 108.71,58.42 112.52,58.42 112.52,56.64 108.71,56.64
N$103  (via drill 0.35)
  Top 0.305: 120.4,57.4 U1.2
  Top 0.508: v119.89,59.18 120.4,58.67 120.4,57.4
  Bottom 0.508: R7.2 119.34,59.73 v119.89,59.18
N$104
  Top 0.813: R6.1 106.68,50.46 108.46,48.68 N6.P$1
N$105
  Top 0.813: R2.1 N2.P$1
N$108
  Bottom 0.305: U9.P$10 41.34,7.49 C14.1 R23.1
N$109
  Bottom 0.508: R20.1 C12.1 15.94,18.56 U8.P$10
N$110
  Bottom 0.508: R25.1 C15.1 66.91,19.19 66.74,19.37 U10.P$10
N$111
  Bottom 0.305: 92.06,10.59 U11.P$10
  Bottom 0.508: C16.1 R27.1 92.06,10.59 U11.P$10
N$118
  Top 0.813: R3.1 N3.P$1
N$121
  Top 0.305: N6.P$12 110.39,45.69 110.39,43.69 109.34,42.64 107.91,42.64 105.79,40.51 105.79,19.34 105.5,19.05 U7.P$16
N$122
  Top 0.305: U7.P$15 107.95,34.54 111.97,38.56 111.97,46.18 112.98,47.19 115.52,47.19 116.41,46.3 N6.P$3
N$123
  Top 0.305: U7.P$8 121.92,12.7 121.92,20.07 119.38,22.61 119.38,39.37 117.86,40.89 117.86,42.16 119.53,43.84 N6.P$4
N$124
  Top 0.305: N6.P$5 121.16,39.51 121.16,22.21 123.19,20.3 U7.P$9
N$125
  Top 0.305: U7.P$13 113.03,33.02 117.95,37.94 N6.P$6
N$126
  Top 0.305: U7.P$14 110.49,32.51 115.62,37.64 N6.P$7
N$127
  Top 0.305: N6.P$8 112.98,37.29 109.22,33.53 109.22,18.41 110.11,17.53 117.35,17.53 118.11,18.31 U7.P$11
N$128  (via drill 0.35)
  Top 0.305: U7.P$10 118.11,21.59 v118.11,35.81
  Bottom 0.305: v118.11,35.81 118.11,37.08 116.13,39.06 N6.P$9
N$129
  Top 0.305: N6.P$10 106.68,38.75 106.68,17.13 105.41,15.99 U7.P$1
N$130
  Top 0.305: N6.P$11 107.34,43.84 105.03,41.53 105.03,21.34 103.94,20.24 103.94,10.8 105.12,9.62 107.28,9.62 107.95,10.29 U7.P$2
N$145
  Top 0.813: R4.1 N4.P$1
N$160
  Bottom 0.813: Q2.C R9.1
N$161
  Bottom 0.813: Q4.C R11.1
N$162
  Bottom 0.305: R11.2 77.15,48.98 N4.P$2
N$163
  Bottom 0.305: R9.2 36.51,48.98 N2.P$2
V+
  Top 1.27: JP2.P$2 JP2.P$1 124.46,45.47 118.36,51.56 112.01,51.56 110.82,52.76 U1.4
  cutout Bottom: 127,31.37 121.92,31.37 121.92,18.03 127,18.03

### Text on the board
tPlace: Rev. A | https://github.com/bmboucher/nixie_ticker
bPlace: D1 | D2 | D3 | D4 | D5 | D6 | 00 D1 8 / 01 D1 P / 02 L1 / 03 D1 1 / 04 D1 2 / 05 D1 4 / 06 D2 P / 07 L2 | 08 D2 1 / 09 D2 8 / 10 D2 2 / 11 D2 4 / 12 D3 P / 13 D3 2 / 14 D3 1 / 15 D3 8 | 24 / 25 D5 P / 26 L5 / 27 D5 1 / 28 D5 8 / 29 D5 2 / 30 D5 4 / 31 | POS | 16 D4 1 / 17 L3 / 18 D3 4 / 19 D4 P / 20 L4 / 21 D4 8 / 22 D4 2 / 23 D4 4 | 32 D6 1 / 32 D6 P / 34 L6 / 35 ANODE / 36 / 37 D6 8 / 38 D6 2 / 39 D6 4 | GND | - | + | L | C | D